# EasyEDA Pro project ProPrj_灵巧手_2025-05-21.epro

# Schematic Schematic2
Board Name: Board2; Create Date: 2025-05-21; Page Name: P1; Project Name: 灵巧手; Schematic Name: Schematic2; Update Date: 2025-05-21; Company: 嘉立创EDA; Page Size: A4; Version: V1.0
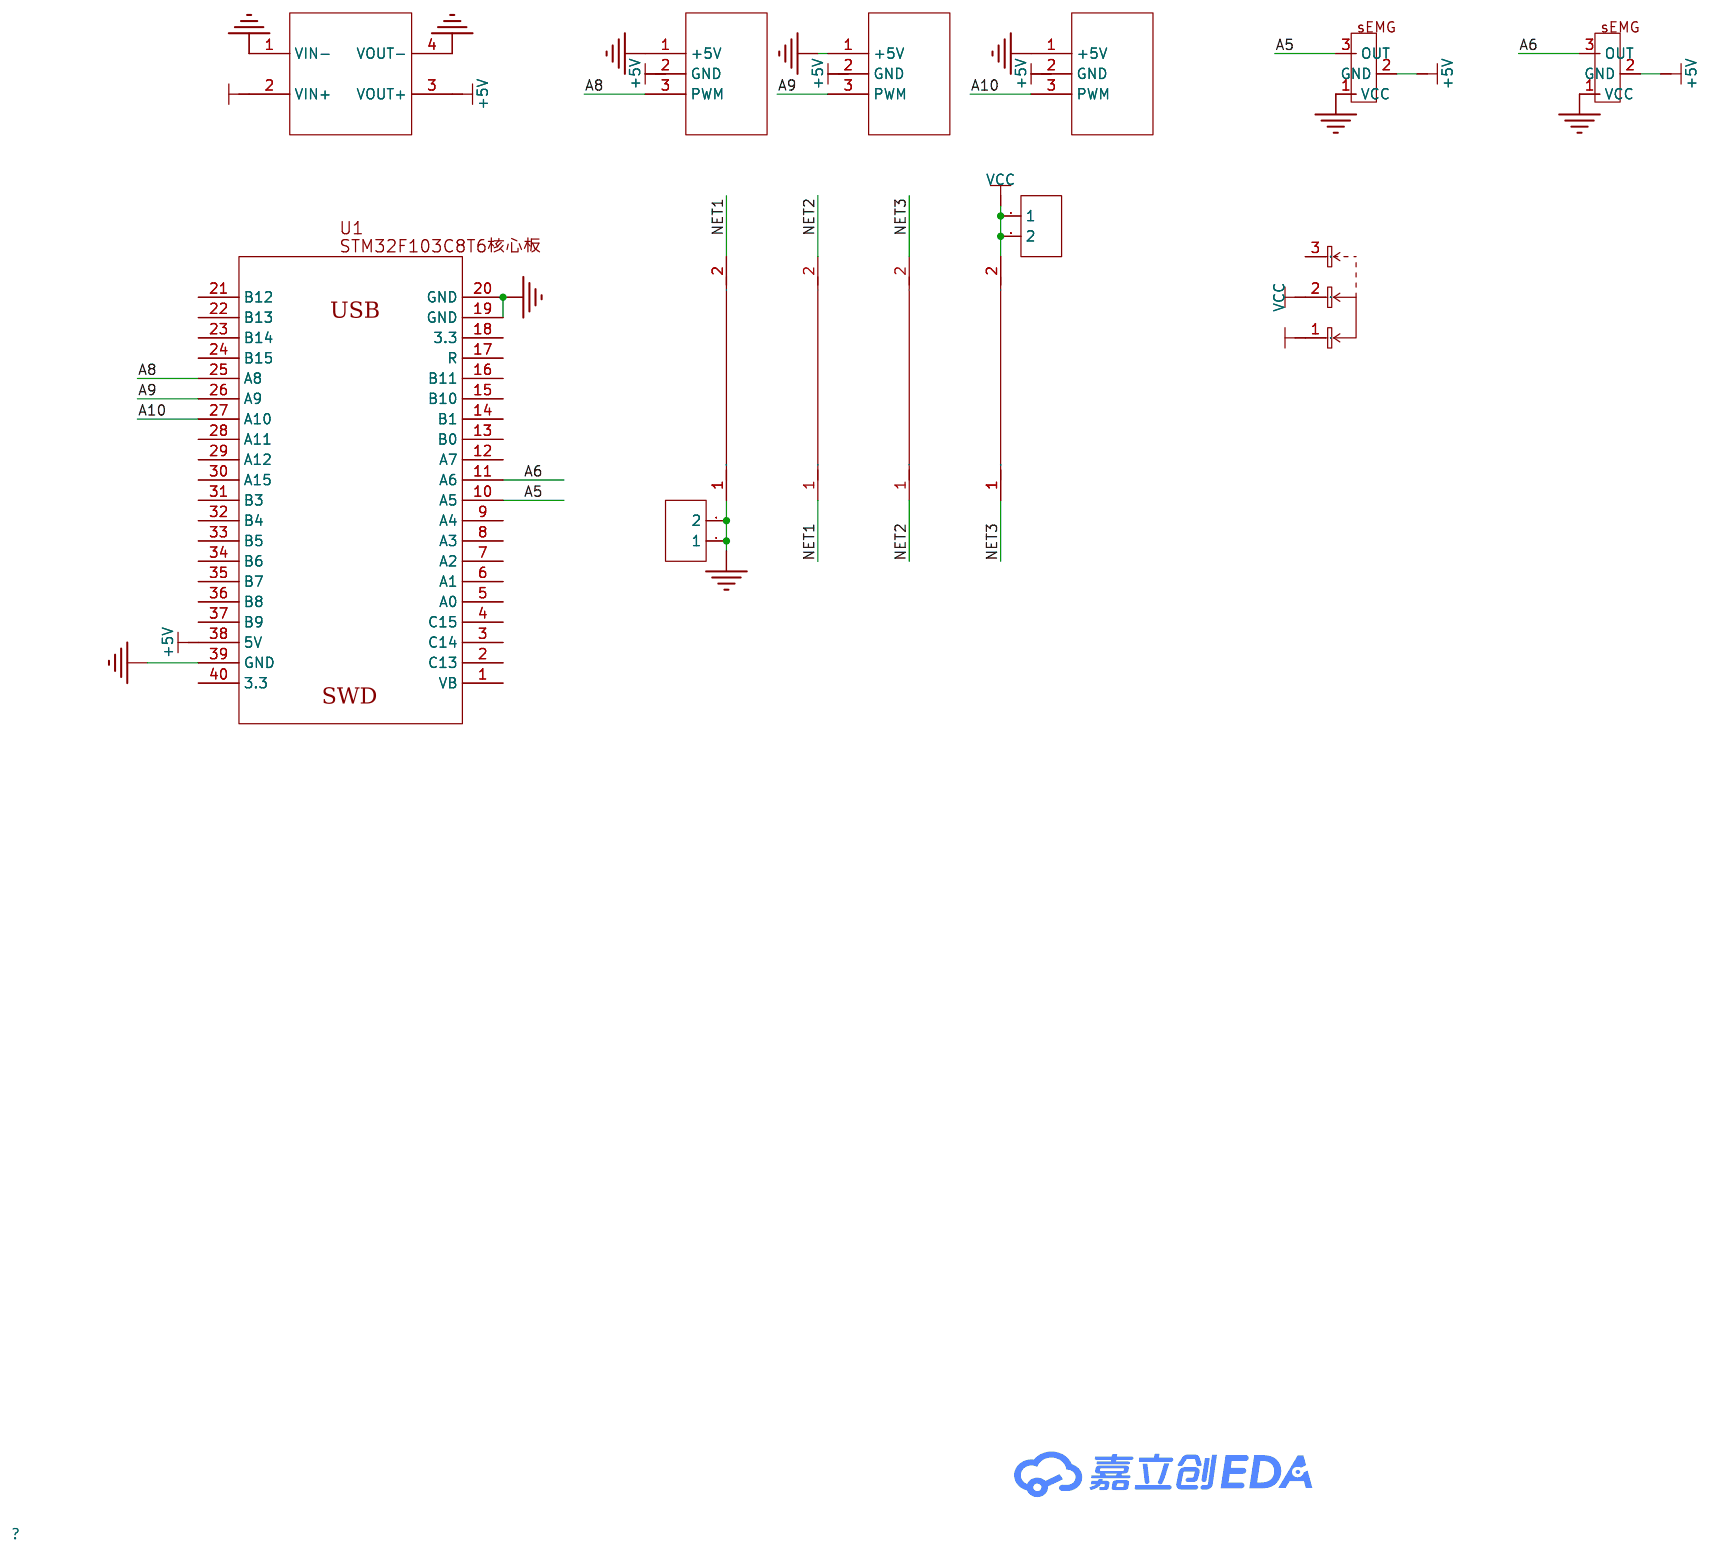
[diagram p0: schematic sheet]

## Parts
H1  -  [HDR-TH_2P-P2.54-V-F]
H2  -  [HDR-TH_2P-P2.54-V-F]
SW1  SS-12D06L5  [SW-TH_3P-P4.70_L11.1-W12.7]
U1  -  [DIP-3-2.54MM]
U3  -  [DIP-3-2.54MM]
U4  -  [sg90]
U5  -  [sg90]
U6  -  [sg90]
U7  -  [STM32F103C8T6核心板]
U8  -  [MP1584EN模块_邮票孔]
U10  -  [bat-th_cr2032]
U11  -  [bat-th_cr2032]
U12  -  [bat-th_cr2032]
U13  -  [bat-th_cr2032]

## Library data of the parts
H1 H2 = HDR-F_2.54_1x2P: Supplier Part: C49661; Supplier Footprint: 插件
SW1 = SS-12D06L5: 电路结构:单刀双掷;安装方式:侧插;开关颜色:黑色;额定电流(DC):3A;额定电压(DC):250V;额定电流(AC):3A;额定电压(AC):250V;机械寿命:1万次;; LCSC Part Name: 柄长5mm 卧插双档 滑动开关; Supplier Part: C319015; Manufacturer: XKB Connectivity(中国星坤); Supplier Footprint: 插件; JLCPCB Part Class: 扩展库; Datasheet: https://atta.szlcsc.com/upload/public/pdf/source/20211009/0D67854FD60FB1F6FE75130AD47C052C.pdf; Supplier: LCSC; Circuit: 单刀双掷; Actuator Style: 矩形柱状; Pin Style: PC引脚; Switch Length: 12.95mm; Switch Width: 6.6mm; Switch Height: 6.3mm; Mounting Style: 侧插; Actuator Color: 黑色; Current Rating (DC): 3A; Voltage Rating (DC): 250V; Current Rating (AC): 3A; Voltage Rating (AC): 250V; Mechanical Life: 1万次; Operating Temperature: -40℃~+85℃
U1 U3 = sEMG
U4-U6 = SG90
U7 = STM32F103核心板
U8 = MP1584EN模块: MP1584END电源模块
U10-U13 = CR2032 (卧式焊脚)20-6*9

## Nets
+5V: U1.2(GND) U3.2(GND) U4.2(GND) U5.2(GND) U6.2(GND) U7.38(5V) U8.3(VOUT+)
+12V: SW1.1 U8.2(VIN+)
GND: H2.1 H2.2 U1.1(VCC) U3.1(VCC) U4.1(+5V) U5.1(+5V) U6.1(+5V) U7.19(GND) U7.20(GND) U7.39(GND) U8.1(VIN-) U8.4(VOUT-) U10.1(+)
VCC: H1.1 H1.2 SW1.2 U13.2(-)
A5: U3.3(OUT) U7.10(A5)
A6: U1.3(OUT) U7.11(A6)
A8: U4.3(PWM) U7.25(A8)
A9: U5.3(PWM) U7.26(A9)
A10: U6.3(PWM) U7.27(A10)
NET1: U10.2(-) U11.1(+)
NET2: U11.2(-) U12.1(+)
NET3: U12.2(-) U13.1(+)

Not connected (* = marked no-connect by the designer): SW1 3; U7 1(VB) 2(C13) 3(C14) 4(C15) 5(A0) 6(A1) 7(A2) 8(A3) 9(A4) 12(A7) 13(B0) 14(B1) 15(B10) 16(B11) 17(R) 18(3.3) 21(B12) 22(B13) 23(B14) 24(B15) 28(A11) 29(A12) 30(A15) 31(B3) 32(B4) 33(B5) 34(B6) 35(B7) 36(B8) 37(B9) 40(3.3)

# Board PCB3
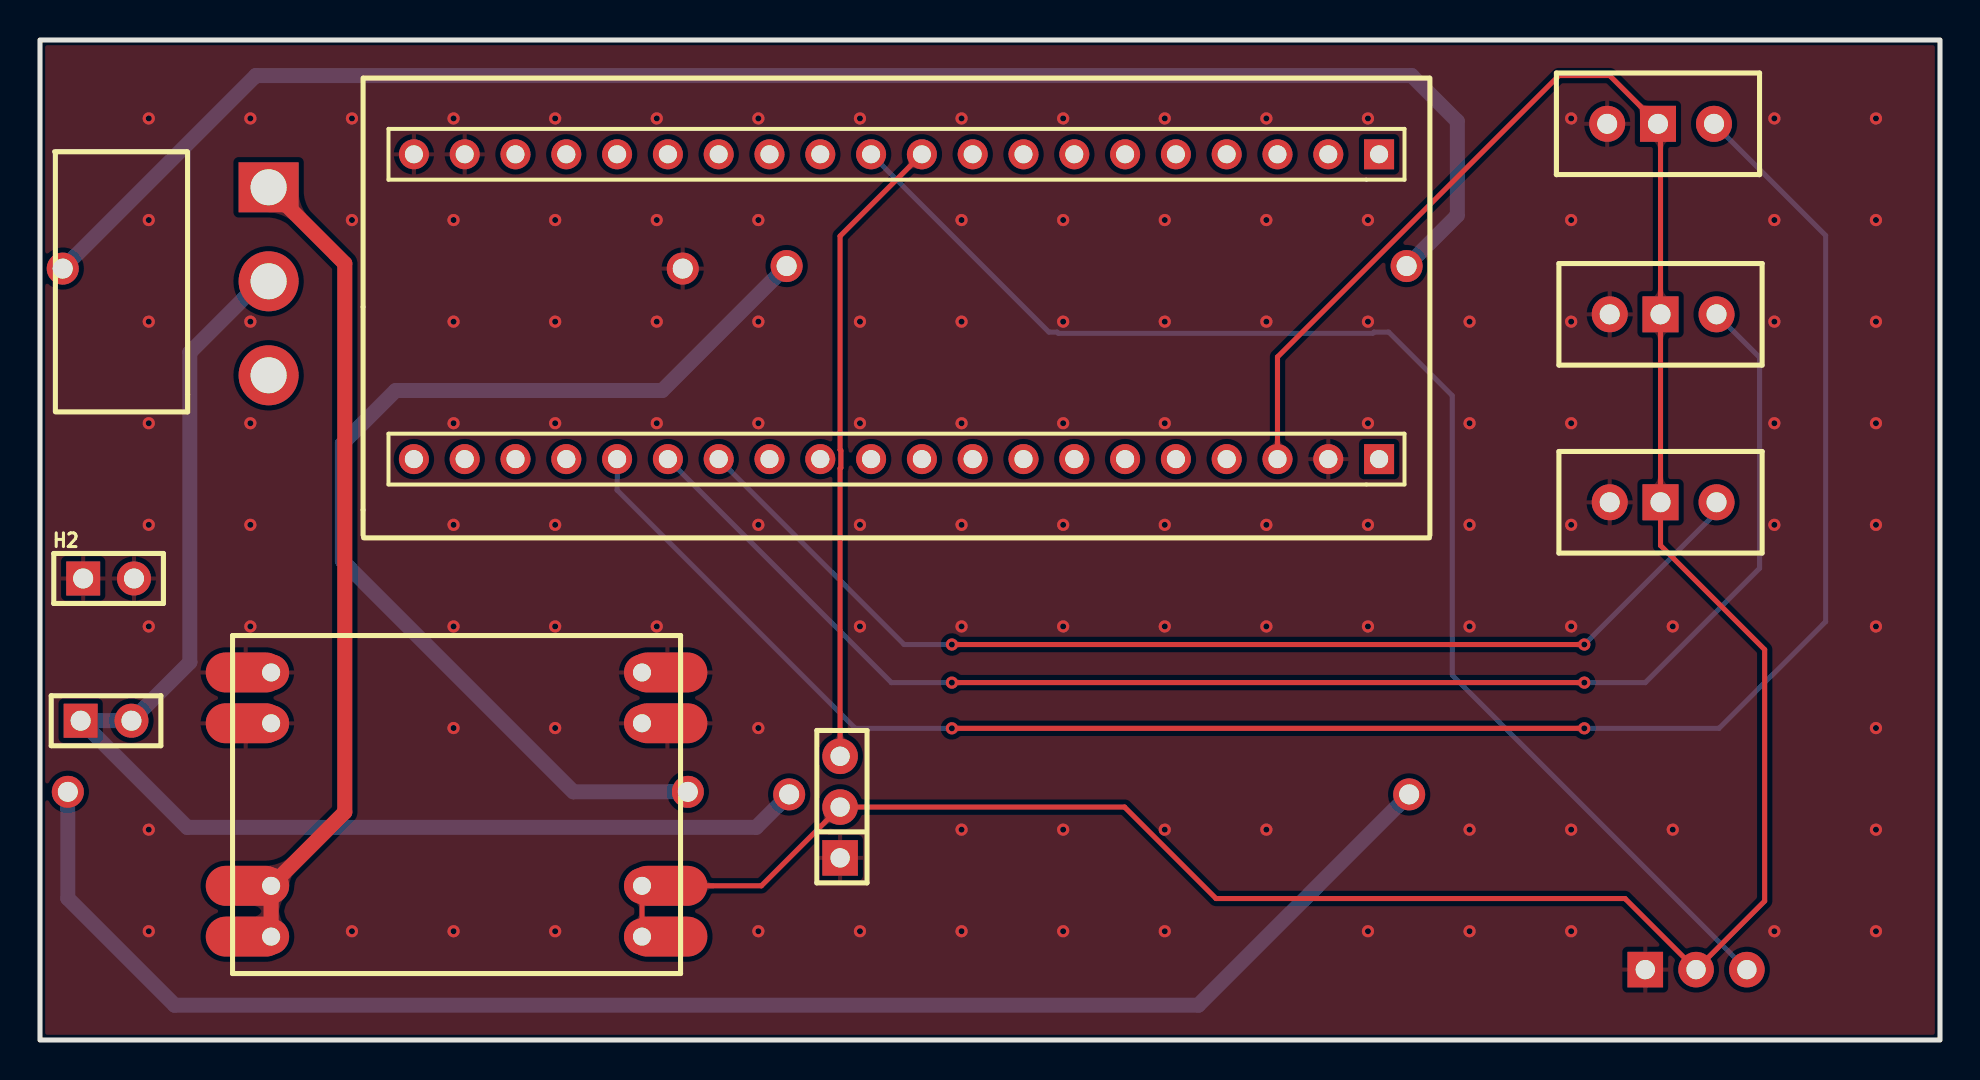
[diagram p1: board, top side]
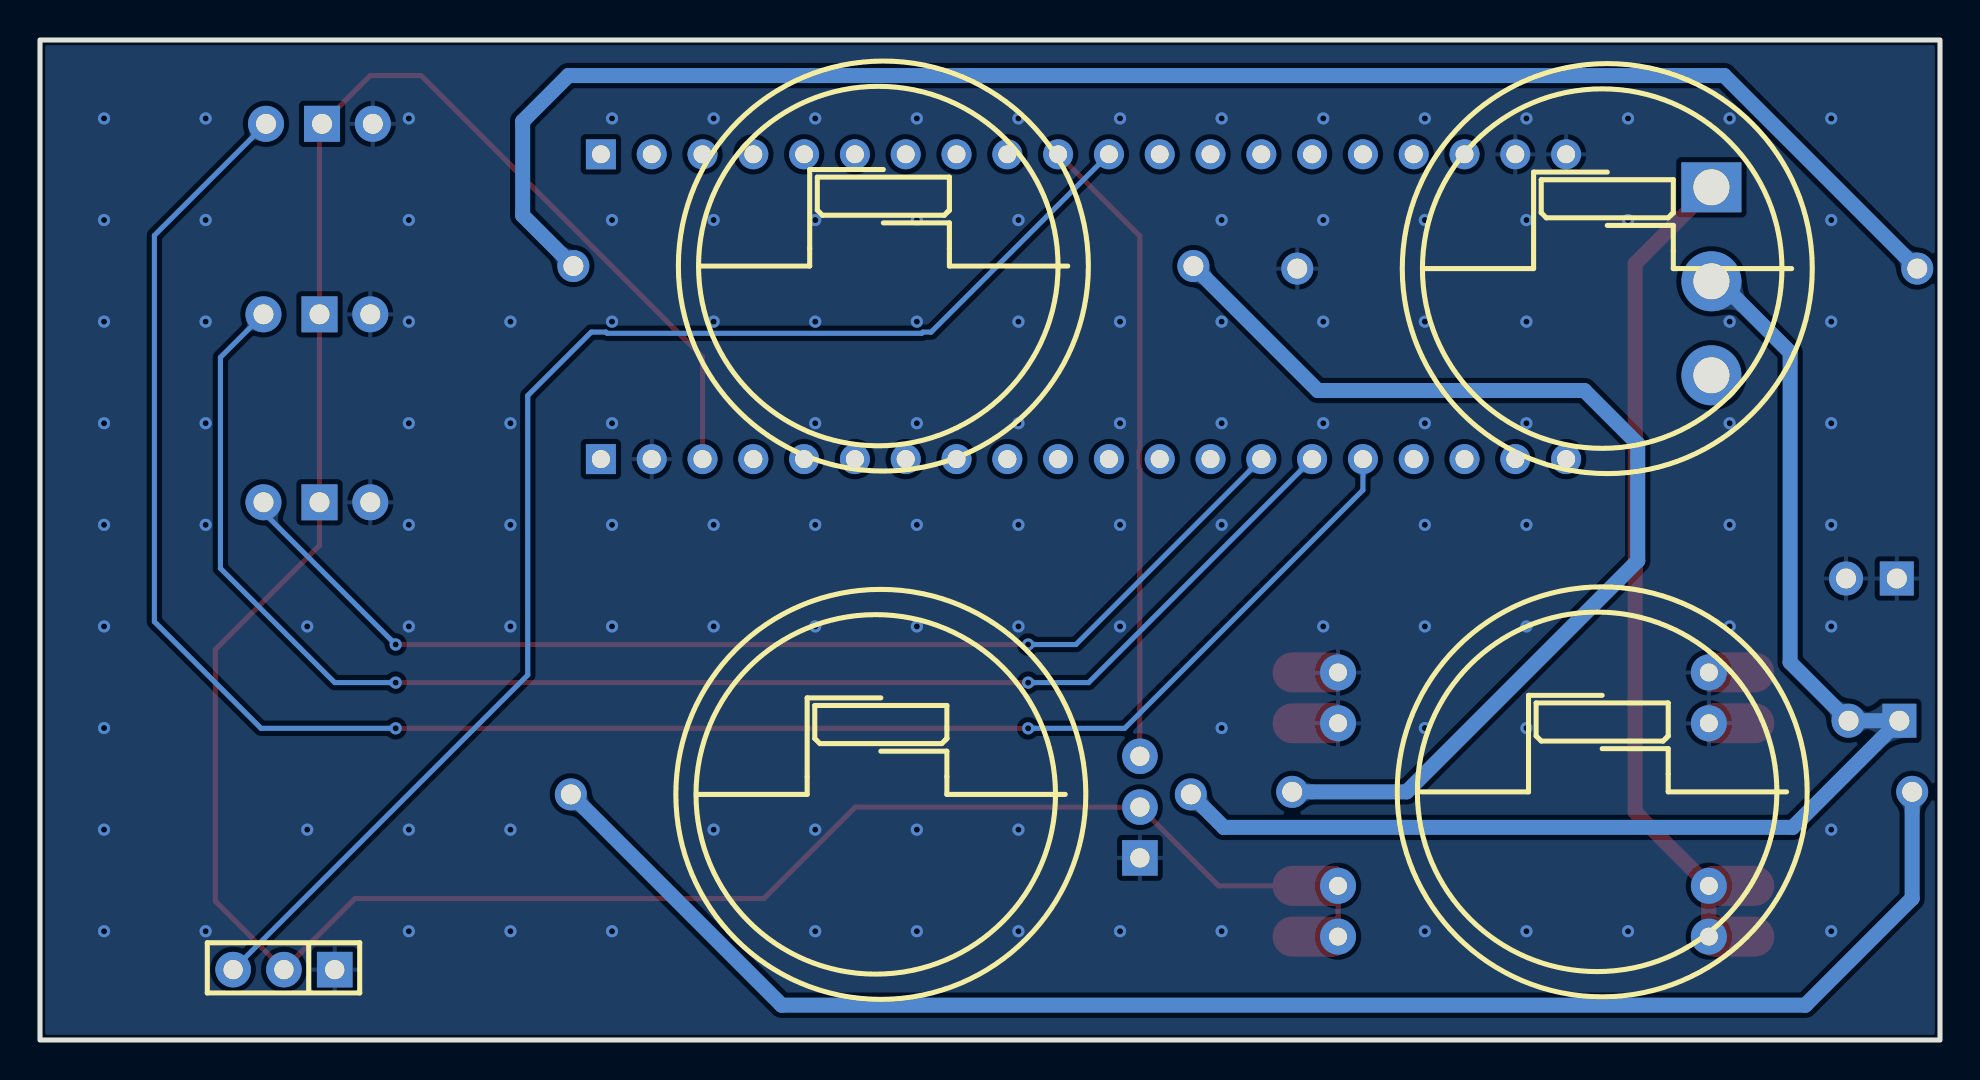
[diagram p2: board, bottom side, seen from below]

Outline 95 x 50 mm; copper layers: Top Layer, Bottom Layer. Coordinates in mm from the lower left corner of the outline.
Outline path: rectangle 0,50 95,0
Stack: Top Layer 0.035mm / Dielectric1 1.51mm FR4 er 4.5 / Bottom Layer 0.035mm

## Design rules (mm)
template: JLCPCB Capability(Two Layers Board)
spacing copperThickness1oz (default): track to track 0.102, other pairs 0.152 to 0.3
spacing copperThickness2oz: track to track 0.203, other pairs 0.152 to 0.3
track width copperThickness1oz (default): min 0.127, default 0.254, max 2.54
track width copperThickness2oz: min 0.203, default 0.254, max 2.54
differential pair differentialPair (default): width min 0.127, default 0.254, max 2.54; gap min 0.152, default 0.152
via viaSize (default): diameter min 0.5, default 0.61, max 10; hole min 0.3, default 0.305, max 6.3

## Placement (name value [footprint] x y rotation side)
H1  -  [HDR-TH_2P-P2.54-V-F]  3.3 15.96 0 top
H2  -  [HDR-TH_2P-P2.54-V-F]  3.43 23.08 0 top
SW1  SS-12D06L5  [SW-TH_3P-P4.70_L11.1-W12.7]  11.43 37.94 270 top
U1  -  [DIP-3-2.54MM]  80.26 3.52 0 bottom
U3  -  [DIP-3-2.54MM]  40 9.11 90 top
U4  -  [sg90]  80.9 45.81 90 top
U5  -  [sg90]  81.03 36.28 90 top
U6  -  [sg90]  81.03 26.89 90 top
U7  -  [STM32F103C8T6核心板]  69.47 24.98 90 top
U8  -  [MP1584EN模块_邮票孔]  20.07 12.28 0 top
U10  -  [bat-th_cr2032]  16.64 38.57 180 bottom
U11  -  [bat-th_cr2032]  52.83 38.7 180 bottom
U12  -  [bat-th_cr2032]  16.89 12.41 180 bottom
U13  -  [bat-th_cr2032]  52.96 12.28 180 bottom

## Footprints (pads in the part's own frame, mm; a bottom-side part is the same pattern mirrored in y, then rotated)
bat-th_cr2032
  round 1.6 hole 1: 1(-15.5,0) 2(15.5,0)
DIP-3-2.54MM
  rect 1.778x1.778 hole 0.965: 1(0,0)
  round 1.778 hole 0.965: 2(2.54,0) 3(5.08,0)
HDR-TH_2P-P2.54-V-F
  rect 1.7x1.7 hole 1: 1(-1.27,0)
  round 1.7 hole 1: 2(1.27,0)
MP1584EN模块_邮票孔
  oval 4x2 smd: 1(-9.779,6.096) 1(-9.779,3.556) 2(-9.779,-4.572) 2(-9.779,-7.112) 3(11.303,-4.572) 3(11.303,-7.112) 4(11.303,6.096) 4(11.303,3.556)
  round 1.8 hole 0.9: 1(-8.509,6.096) 1(-8.509,3.556) 2(-8.509,-4.572) 2(-8.509,-7.112) 3(10.033,-4.572) 3(10.033,-7.112) 4(10.033,6.096) 4(10.033,3.556)
sg90
  round 1.8 hole 1: 1(0,2.54) 3(0,-2.801)
  rect 1.8x1.8 hole 1: 2(0,0)
STM32F103C8T6核心板
  rect 1.5x1.5 hole 0.9: 1(19.304,2.514)
  round 1.5 hole 0.9: 2(19.304,5.054) 3(19.304,7.595) 4(19.304,10.134) 5(19.304,12.675) 6(19.304,15.214) 7(19.304,17.755) 8(19.304,20.294) 9(19.304,22.834) 10(19.304,25.375) 11(19.304,27.915) 12(19.304,30.454) 14(19.304,35.535) 18(19.304,45.694) 19(19.304,48.234) 20(19.304,50.775)
  round 1.5 hole 0.9x0.905: 13(19.304,32.995) 15(19.304,38.075) 16(19.304,40.614) 17(19.304,43.154) 21(4.064,50.775) 22(4.064,48.234) 23(4.064,45.694) 24(4.064,43.154) 25(4.064,40.614) 26(4.064,38.075) 27(4.064,35.535) 28(4.064,32.995) 29(4.064,30.454) 30(4.064,27.915) 31(4.064,25.375) 32(4.064,22.834) 33(4.064,20.294) 34(4.064,17.755) 35(4.064,15.214) 36(4.064,12.675) 37(4.064,10.134) 38(4.064,7.595) 39(4.064,5.054)
  rect 1.5x1.5 hole 0.9x0.905: 40(4.064,2.514)
SW-TH_3P-P4.70_L11.1-W12.7
  rect 2.5x3 hole 1.8: 1(-4.7,0)
  round 3 hole 1.8: 2(0,0) 3(4.7,0)

## Nets
As in the schematic.

Pads without a net: SW1 3; U7 1 2 3 4 5 6 7 8 9 12 13 14 15 16 17 18 21 22 23 24 28 29 30 31 32 33 34 35 36 37 40

## Via types
v1: diameter 0.61, hole 0.305, Top Layer to Bottom Layer, 124 vias

## Routing (per net, layer and track width the routed paths; a pad name or vN(x,y) marks a point on that pad's centre or on a via; arc(x,y) is an arc through that point)
+5V: length 137.1
  Top Layer w0.254: U7.38 61.87,34.15 75.95,48.22 78.49,48.22 U4.2 81.03,45.68 U5.2 U6.2 81.03,24.73 86.23,19.52 86.23,6.95 U1.2 79.25,7.07 58.8,7.07 54.23,11.65 U3.2 36.07,7.71 U8.3 30.1,5.17
+12V: length 40.6
  Top Layer w0.75: 11.56,5.17 U8.2 15.24,11.39 15.24,38.83 SW1.1
GND:
  vias: v1(5.44,46.08) v1(5.44,41) v1(5.44,35.92) v1(5.44,30.84) v1(5.44,25.76) v1(5.44,20.68) v1(5.44,10.52) v1(5.44,5.44) v1(10.52,46.08) v1(10.52,35.92) v1(10.52,30.84) v1(10.52,25.76) v1(10.52,20.68) v1(15.6,46.08) v1(15.6,41) v1(15.6,5.44) v1(20.68,46.08) v1(20.68,41) v1(20.68,35.92) v1(20.68,30.84) v1(20.68,25.76) v1(20.68,20.68) v1(20.68,15.6) v1(20.68,5.44) v1(25.76,46.08) v1(25.76,41) v1(25.76,35.92) v1(25.76,30.84) v1(25.76,25.76) v1(25.76,20.68) v1(25.76,15.6) v1(25.76,5.44) v1(30.84,46.08) v1(30.84,41) v1(30.84,35.92) v1(30.84,30.84) v1(30.84,20.68) v1(35.92,46.08) v1(35.92,41) v1(35.92,35.92) v1(35.92,30.84) v1(35.92,25.76) v1(35.92,15.6) v1(35.92,5.44) v1(41,46.08) v1(41,35.92) v1(41,30.84) v1(41,25.76) v1(41,20.68) v1(41,5.44) v1(46.08,46.08) v1(46.08,41) v1(46.08,35.92) v1(46.08,30.84) v1(46.08,25.76) v1(46.08,20.68) v1(46.08,10.52) v1(46.08,5.44) v1(51.16,46.08) v1(51.16,41) v1(51.16,35.92) v1(51.16,30.84) v1(51.16,25.76) v1(51.16,20.68) v1(51.16,10.52) v1(51.16,5.44) v1(56.24,46.08) v1(56.24,41) v1(56.24,35.92) v1(56.24,30.84) v1(56.24,25.76) v1(56.24,20.68) v1(56.24,10.52) v1(56.24,5.44) v1(61.32,46.08) v1(61.32,41) v1(61.32,35.92) v1(61.32,25.76) v1(61.32,20.68) v1(61.32,10.52) v1(66.4,46.08) v1(66.4,41) v1(66.4,35.92) v1(66.4,30.84) v1(66.4,25.76) v1(66.4,20.68) v1(66.4,5.44) v1(71.48,35.92) v1(71.48,30.84) v1(71.48,25.76) v1(71.48,20.68) v1(71.48,10.52) v1(71.48,5.44) v1(76.56,46.08) v1(76.56,41) v1(76.56,35.92) v1(76.56,30.84) v1(76.56,25.76) v1(76.56,20.68) v1(76.56,10.52) v1(76.56,5.44) v1(81.64,20.68) v1(81.64,10.52) v1(86.72,46.08) v1(86.72,41) v1(86.72,35.92) v1(86.72,30.84) v1(86.72,25.76) v1(86.72,5.44) v1(91.8,46.08) v1(91.8,41) v1(91.8,35.92) v1(91.8,30.84) v1(91.8,25.76) v1(91.8,20.68) v1(91.8,15.6) v1(91.8,10.52) v1(91.8,5.44)
VCC: length 65.9
  Bottom Layer w0.75: U13.2 35.81,10.63 7.37,10.63 H1.1 H1.2 7.49,18.89 7.49,34.38 11.05,37.94 SW1.2
A5: length 31.8
  Top Layer w0.254: U7.10 40,40.2 40,29.51 40.04,29.47 40.04,28.62 40,28.58 U3.3
A6: length 68.9
  Bottom Layer w0.254: U1.3 70.61,18.25 70.61,32.22 67.44,35.39 66.7,35.39 66.64,35.33 50.92,35.33 50.86,35.39 50.44,35.39 U7.11
A8: length 96.3
  Top Layer w0.254: v1(77.22,15.58) v1(45.59,15.58)
  Bottom Layer w0.254: U7.25 28.85,27.5 40.77,15.58 v1(45.59,15.58) ; U4.3 89.28,40.23 89.28,20.92 83.95,15.58 v1(77.22,15.58)
A9: length 75.2
  Top Layer w0.254: v1(77.22,17.87) v1(45.59,17.87)
  Bottom Layer w0.254: U7.26 42.57,17.87 v1(45.59,17.87) ; U5.3 85.98,34.13 85.98,23.58 80.26,17.87 v1(77.22,17.87)
A10: length 57
  Top Layer w0.254: v1(77.22,19.77) v1(45.59,19.77)
  Bottom Layer w0.254: U6.3 83.83,26.39 v1(77.22,19.77) ; U7.27 43.21,19.77 v1(45.59,19.77)
NET1: length 83
  Bottom Layer w0.75: U11.1 70.87,41.23 70.87,45.94 68.58,48.22 10.79,48.22 U10.2
NET2: length 53.8
  Bottom Layer w0.75: U12.1 26.67,12.41 15.11,23.97 15.11,29.81 17.78,32.47 31.11,32.47 U11.2
NET3: length 79
  Bottom Layer w0.75: U13.1 57.92,1.74 6.73,1.74 1.39,7.08 U12.2

## Copper pours and planes (outline as drawn; the poured copper is in the pictures)
GND on Top Layer: -4.95,55.84 100.2,55.84 100.2,-4.1 -4.95,-4.1
GND on Bottom Layer: -9.91,55.72 101.35,55.72 101.35,-3.72 -9.91,-3.72

Small or netless copper shapes (teardrops, artwork), in the pictures only: 28 on Top Layer, 24 on Bottom Layer
